# Altium schematic sheet adafruit flora mainboard 2.SchDoc: adafruit flora mainboard 2
size 301 x 234 mm; Date: 2019/8/22 下午 4:10:12; SheetNumber: 1; GateName_1: G$1; SymbolName_1: FRAME_A_L; LibraryName: frames; DeviceSetName: FRAME_A_L; GateName_2: G$2; SymbolName_2: DOCFIELD; Sheet: Sheet:; REV: REV:
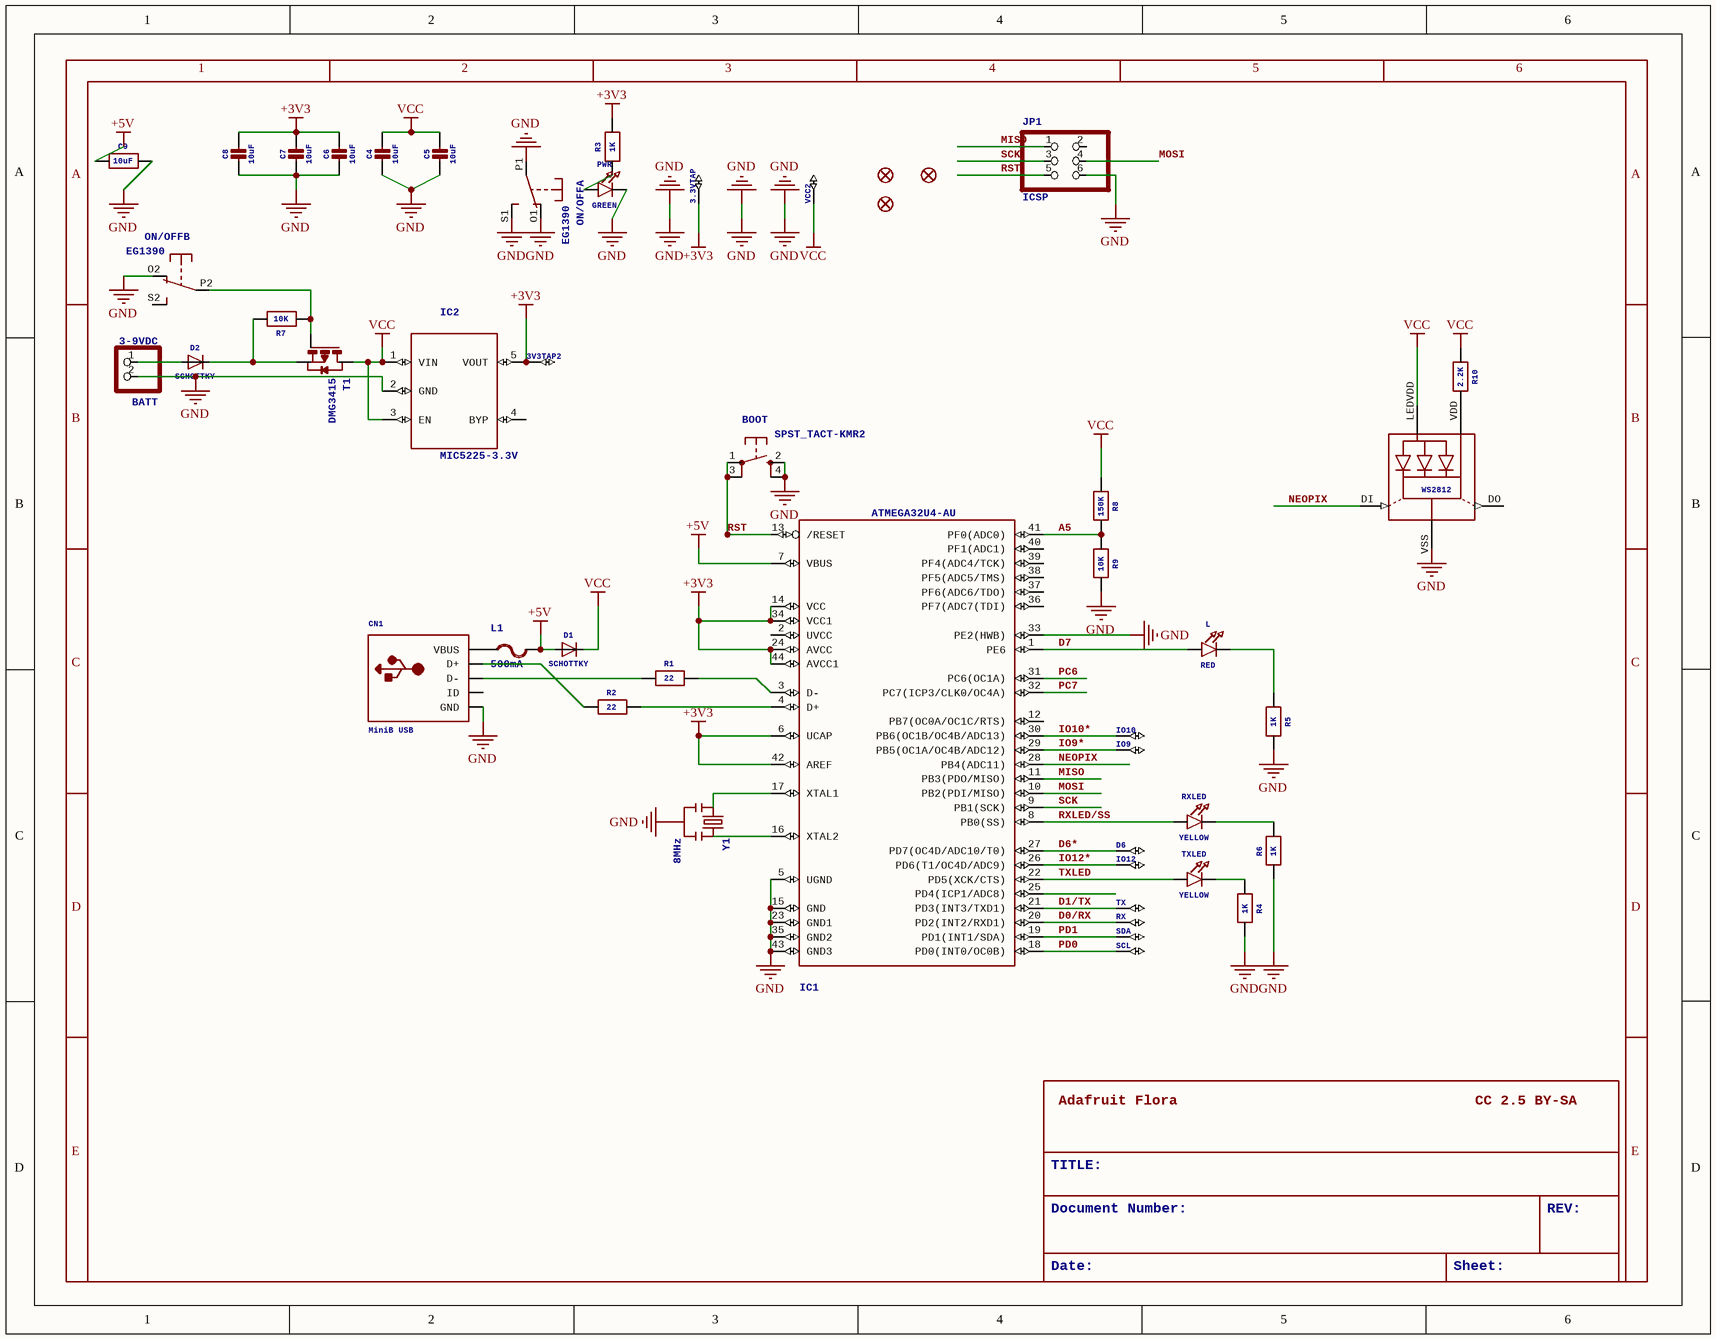
[diagram p0: adafruit flora mainboard 2.SchDoc]

## Parts
3.3VTAP  SEWTAP-2.0IN  [SEWINGTAP_2.0]  (value not drawn)
3V3TAP2  SEWTAP-2.0IN  [SEWINGTAP_2.0]  (value not drawn)
BATT  3-9VDC  [JST-PH-2-SMT-RA]
BOOT  SPST_TACT-KMR2  [KMR2]
C4  10uF  [0805-NO]
C5  10uF  [0805-NO]
C6  10uF  [0805-NO]
C7  10uF  [0805-NO]
C8  10uF  [0805-NO]
C9  10uF  [_0805MP]
CN1  MiniB USB  [4UCONN_20329]
D1  SCHOTTKY  [SOD-123]
D2  SCHOTTKY  [SOD-123]
D6  SEWTAP-2.0IN  [SEWINGTAP_2.0]  (value not drawn)
IC1  ATMEGA32U4-AU  [TQFP44]
IC2  MIC5225-3.3V  [SOT23-5L]
IO9  SEWTAP-2.0IN  [SEWINGTAP_2.0]  (value not drawn)
IO10  SEWTAP-2.0IN  [SEWINGTAP_2.0]  (value not drawn)
IO12  SEWTAP-2.0IN  [SEWINGTAP_2.0]  (value not drawn)
JP1  ICSP  [2X03]
L  RED  [CHIPLED_0805_NOOUTLINE]
L1  500mA  [R1206]
LED1  WS2812  [WS2812]
ON/OFF  EG1390  [EG1390]  (parts A,B of 2)
PWR  GREEN  [CHIPLED_0805_NOOUTLINE]
R1  22  [0805-NO]
R2  22  [0805-NO]
R3  1K  [_0805MP]
R4  1K  [_0805MP]
R5  1K  [0805-NO]
R6  1K  [0805-NO]
R7  10K  [_0805MP]
R8  150K  [0805-NO]
R9  10K  [0805-NO]
R10  2.2K  [0805-NO]
RX  SEWTAP-2.0IN  [SEWINGTAP_2.0]  (value not drawn)
RXLED  YELLOW  [CHIPLED_0805_NOOUTLINE]
SCL  SEWTAP-2.0IN  [SEWINGTAP_2.0]  (value not drawn)
SDA  SEWTAP-2.0IN  [SEWINGTAP_2.0]  (value not drawn)
T1  DMG3415  [SOT-23]
TX  SEWTAP-2.0IN  [SEWINGTAP_2.0]  (value not drawn)
TXLED  YELLOW  [CHIPLED_0805_NOOUTLINE]
U$2  FIDUCIAL""  [FIDUCIAL_1MM]  (value not drawn)
U$3  FIDUCIAL""  [FIDUCIAL_1MM]  (value not drawn)
U$6  FIDUCIAL""  [FIDUCIAL_1MM]  (value not drawn)
VCC2  SEWTAP-2.0IN  [SEWINGTAP_2.0]  (value not drawn)
Y1  8MHz  [RESONATOR-SMD]

## Nets
+3V3: 3.3VTAP.P$1(SEW) 3V3TAP2.P$1(SEW) C6.1 C7.1 C8.1 IC1.6(UCAP) IC1.14(VCC) IC1.24(AVCC) IC1.34(VCC1) IC1.42(AREF) IC1.44(AVCC1) IC2.5(VOUT) R3.2
+5V: C9.1 D1.A IC1.7(VBUS) L1.2
GND: BATT.2 BOOT.2(S) BOOT.4(S1) C4.2 C5.2 C6.2 C7.2 C8.2 C9.2 CN1.BASE@1_BASE@2_GND_SPRT@1_SPRT@2_SPRT@3_SPRT@4(GND) IC1.5(UGND) IC1.15(GND) IC1.23(GND1) IC1.33(PE2(HWB)) IC1.35(GND2) IC1.43(GND3) IC2.2(GND) JP1.6 LED1.VSS(GND) ON/OFF.O1(O) ON/OFF.O2(O) ON/OFF.P1(P) ON/OFF.S1(S) PWR.C R4.2 R5.2 R6.1 R9.2 Y1.2
VCC: C4.1 C5.1 D1.C IC2.1(VIN) IC2.3(EN) LED1.LEDVDD R8.1 R10.1 T1.1(D) VCC2.P$1(SEW)
A5: IC1.41(PF0(ADC0)) R8.2 R9.1
D0/RX: IC1.20(PD2(INT2/RXD1)) RX.P$1(SEW)
D1/TX: IC1.21(PD3(INT3/TXD1)) TX.P$1(SEW)
D6*: D6.P$1(SEW) IC1.27(PD7(OC4D/ADC10/T0))
D7: IC1.1(PE6) L.A
IO9*: IC1.29(PB5(OC1A/OC4B/ADC12)) IO9.P$1(SEW)
IO10*: IC1.30(PB6(OC1B/OC4B/ADC13)) IO10.P$1(SEW)
IO12*: IC1.26(PD6(T1/OC4D/ADC9)) IO12.P$1(SEW)
MISO: IC1.11(PB3(PDO/MISO)) JP1.1
MOSI: IC1.10(PB2(PDI/MISO)) JP1.4
NEOPIX: IC1.28(PB4(ADC11)) LED1.DI
PC6: IC1.31(PC6(OC1A))
PC7: IC1.32(PC7(ICP3/CLK0/OC4A))
PD0: IC1.18(PD0(INT0/OC0B)) SCL.P$1(SEW)
PD1: IC1.19(PD1(INT1/SDA)) SDA.P$1(SEW)
RST: BOOT.1(P) BOOT.3(P1) IC1.13(/RESET) JP1.5
RXLED/SS: IC1.8(PB0(SS)) RXLED.A
SCK: IC1.9(PB1(SCK)) JP1.3
TXLED: IC1.22(PD5(XCK/CTS)) TXLED.A
NetBATT_1: BATT.1 D2.A
NetCN1_D+: CN1.D+ R2.1
NetCN1_D-: CN1.D- R1.1
NetCN1_VBUS: CN1.VBUS L1.1
NetD2_C: D2.C R7.2 T1.2(S)
NetIC1_3: IC1.3(D-) R1.2
NetIC1_4: IC1.4(D+) R2.2
NetIC1_16: IC1.16(XTAL2) Y1.3
NetIC1_17: IC1.17(XTAL1) Y1.1
NetL_C: L.C R5.1
NetLED1_VDD: LED1.VDD R10.2
NetON/OFF_P2: ON/OFF.P2(P) R7.1 T1.3(G)
NetPWR_A: PWR.A R3.1
NetR4_1: R4.1 TXLED.C
NetR6_2: R6.2 RXLED.C

Not connected (* = marked no-connect by the designer): CN1 ID; IC1 2(UVCC) 12(PB7(OC0A/OC1C/RTS)) 25(PD4(ICP1/ADC8)) 36(PF7(ADC7(TDI)) 37(PF6(ADC6/TDO)) 38(PF5(ADC5/TMS)) 39(PF4(ADC4/TCK)) 40(PF1(ADC1)); IC2 4(BYP); JP1 2; LED1 DO; ON/OFF S2(S)

## Notes on the sheet
- Adafruit Flora
- CC 2.5 BY-SA
- TITLE:
- Document Number:
- REV:
- Date:
- Sheet:
- 1
- 2
- 3
- 4
- 5
- 6
- A
- B
- C
- D
- E

## Library data of the parts
3.3VTAP 3V3TAP2 D6 IO9 IO10 IO12 RX SCL SDA TX VCC2 = SEWTAP-2.0IN: GateName_1: G$1; SymbolName_1: SEWTAP; DeviceName: -2.0IN; LibraryName: adafruit; DeviceSetName: SEWTAP
BATT = JST_2PIN-SMT-RA: JST 2-Pin Connectors of various flavors SMT-RA (S2B-PH-SM4) 4UConnector #17311  SMT  (B2B-PH-SM4)  THM-RA (S2B-PH)  THM  (B2B-PH); GateName_1: G$1; SymbolName_1: PINHD2; DeviceName: -SMT-RA; LibraryName: adafruit; DeviceSetName: JST_2PIN
BOOT = SPST_TACT-KMR2: SMT 6mm switch, EVQQ2 series    http://www.ladyada.net/library/eagle; GateName_1: G$1; SymbolName_1: TS2; DeviceName: -KMR2; LibraryName: adafruit; DeviceSetName: SPST_TACT
C4-C8 = CAP_CERAMIC0805-NOOUTLINE: Ceramic Capacitors   For new designs, use the packages preceded by an '_' character since they are more reliable:   The following footprints should be used on most boards: _0402 - Standard footprint for regular board layouts  _0603 - Standard footprint for regular board layouts  _0805 - Standard footprint for regular board layouts  _1206 - Standard footprint for regular board layouts       For extremely tight-pitch boards where space is at a premium, the following 'micro-pitch' footprints can be used (smaller pads, no silkscreen outline, etc.): _0402MP - Micro-pitch footprint for very dense/compact boards  _0603MP - Micro-pitch footprint for very dense/compact boards  _0805MP - Micro-pitch footprint for very dense/compact boards  _1206MP - Micro-pitch footprint for very dense/compact boards; GateName_1: G$1; SymbolName_1: CAPACITOR; DeviceName: 0805-NOOUTLINE; LibraryName: microbuilder; DeviceSetName: CAP_CERAMIC
C9 R3 R4 R7 = RESISTOR_0805MP: Resistors   For new designs, use the packages preceded by an '_' character since they are more reliable:   The following footprints should be used on most boards: _0402 - Standard footprint for regular board layouts  _0603 - Standard footprint for regular board layouts  _0805 - Standard footprint for regular board layouts  _1206 - Standard footprint for regular board layouts       For extremely tight-pitch boards where space is at a premium, the following 'micro-pitch' footprints can be used (smaller pads, no silkscreen outline, etc.): _0402MP - Micro-pitch footprint for very dense/compact boards  _0603MP - Micro-pitch footprint for very dense/compact boards  _0805MP - Micro-pitch footprint for very dense/compact boards  _1206MP - Micro-pitch footprint for very dense/compact boards; GateName_1: G$1; SymbolName_1: RESISTOR; DeviceName: _0805MP; LibraryName: microbuilder; DeviceSetName: RESISTOR
CN1 = USBMICRO_20329: USB ConnectorsUSBMINIB - Surface Mount Female Mini-B USB Connector    4UConnector: 06564; GateName_1: G$1; SymbolName_1: USB; DeviceName: MICRO_20329; LibraryName: microbuilder; DeviceSetName: USB
D1 D2 = DIODESOD-123: Diode    SMA      Model	  Volts	  Amps	  Type	  Vf	  Ir	  Digikey #	  Notes	     SSA34-E3	  40V	  3A	  Schottky	  480mV @ 3A	  200uA @ 40V	  SSA34-E3/61TGITR-ND	  	     CDBA120-G	  20V	  1A	  Schottky	  500mV @ 1A	  500uA @ 20V	  641-1014-6-ND	  REEL	     MBRA210	  10V	  2A	  Schottky	  350mV @ 2A	  700uA @ 10V	  MBRA210LT3	  	 SOD-123      Model	  Volts	  Amps	  Type	  Vf	  Ir	  Order #	  Notes	     BAT54T1G	  30V	  200mA	  Schottky	  800mV @ 200mA	  2uA @ 25V	  BAT54T1GOSTR-ND	  	     B0530W	  30V	  500mA	  Schottky	  430mV @ 500mA	  130uA @ 30V	  B0530W-FDICT-ND	  REEL	     MBR120	  20V	  1A	  Schottky	  340mV @ 1A	  	  MBR120VLSFT1GOSCT-ND	  	 SOD-323      Model	  Volts	  Amps	  Type	  Vf	  Ir	  Order #	  Notes	     PMEG2005EJ	  20V	  500mA	  Schottky	  355mV @ 500mA	  	  568-4110-1-ND	  	     ZLLS410	  10V	  570mA	  Schottky	  380mV @ 570mA	  	  ZLLS410CT-ND	  	     1N4148WS	  75V	  150mA	  Silicon/Simple	  1V	  	  1N4148WSFSCT-ND	  REEL	 SOD-523      Model	  Volts	  Amps	  Type	  Vf	  Ir	  Order #	  Notes	     BAT54XV2	  30V	  200mA	  Schottky	  0.8V @ 100mA	  	  BAT54XV2CT-ND	  	     TB751S	  30V	  30mA	  Schottky	  	  	  RB751S-40TE61CT-ND	  	 SOT23-R/W (R = Solder Paste/Reflow Ovens, W = Hand-Soldering)       Model	  Volts	  Amps	  Type	  Vf	  Ir	  Order #	  Notes	     BAT54FILM	  40V	  300mA	  Schottky	  	  	  497-7162-1-ND	  	 POWERDI-5       Model	  Volts	  Amps	  Type	  Vf	  Ir	  Order #	  Notes	     PDS560	  60V	  5A	  Schottky	  670mV @ 5A	  150uA @ 60V	  PDS560DICT-ND; GateName_1: G$1; SymbolName_1: DIODE; DeviceName: SOD-123; LibraryName: microbuilder; DeviceSetName: DIODE
IC1 = ATMEGA32U4-AU: GateName_1: G$1; DeviceName: -AU; SymbolName_1: ATMEGA32U4; LibraryName: adaprog; DeviceSetName: ATMEGA32U4
IC2 = LP298XS: GateName_1: G$1; SymbolName_1: LP298X; DeviceName: S; LibraryName: adafruit; DeviceSetName: LP298X
JP1 = PINHD-2X3: PIN HEADER; GateName_1: A; SymbolName_1: PINH2X3; LibraryName: pinhead; DeviceSetName: PINHD-2X3
L PWR RXLED TXLED = LED0805_NOOUTLINE: LED0603 - 0603 Surface Mount Package    2mA: Green LED - Low Power (3.9mcd, 2ma, 1.7Vf) - Digikey: 475-2709-2-ND  Orange LED - Low Power (9.8mcd, 2ma, 1.8Vf) - Digikey: 475-1194-2-ND  Red LED - Low Power (5mcd, 2ma, 1.8Vf) - Digikey: 475-1195-2-ND  Yellow LED - Low Power (7mcd, 2ma, 1.8Vf) - Digikey: 475-1196-2-ND       5mA: Blue LED - Low Power (17mcd, 5ma, 2.9Vf) - Digikey: LNJ937W8CRACT-ND    0805 - 0805 Surface Mount Package    2mA: Red LED (8.8mcd, 2mA, 1.8Vf, Clear) - Low Power [Digikey: 475-2510-1-ND]  Green LED (5mcd, 2mA, 1.8Vf, Clear) - Low Power [Digikey: 475-2730-1-ND]  Yellow LED (11.3mcd, 2mA, 1.8Vf, Clear) - Low Power [Digikey: 475-2555-1-ND]       20mA: Red LED (104mcd, 20mA, Diffused) - LS R976 [Digikey: 475-1278-6-ND]  Red LED (12mcd, 20mA, 2.0Vf, Clear) - APT2012EC [Digikey: 754-1128-1-ND]  Green LED (15mcd, 20mA, 2.2Vf, Clear) - APT2012GC [Digikey: 754-1131-1-ND]  Orange LED (160mcd, 20mA, 2.1Vf, Clear) - APT2012SECK [Digikey: 754-1130-1-ND]     1206 - 1206 Surface Mount Package  Green LED (26mcd, 20mA, Diffused) - LG N971  [Digikey: 475-1407-6-ND]  Red LED (15mcd, 20mA, Diffused) - LH N974 [Digikey: 475-1416-6-ND]     Cree - Cree High-Power Surface Mount LEDs  XPEBWT-L1-0000-00D50 - White 111lm 350mA 2.9Vf 6200K 110掳  XTEAWT-00-0000-00000LEE3 - White 114lm 350mA 2.85Vf 5000K 115掳     Everlight - Everlight 45-21 Series Surface Mount LEDs  45-21/QK2C-B2832AC2CB2/2T - Warm White 2000mcd 20mA 3.25Vf 3050K 120掳  45-21/LK2C-B38452C4CB2/2T - Nuetral White 2000mcd 20mA 3.25Vf 4150K 120掳  45-21/LK2C-B50634C6CB2/2T - Cold White 2200mcd 20mA 3.25Vf 5650K 120掳     PLCC2 Reverse Mount LS T77K-J1L2-1-0-2-R18-Z - Red 11.25mcd 2mA 1.8Vf 630nm 120掳  LO T77K-L1M2-24-Z - Orange 19.6mcd 2mA 1.8Vf 606nm 120掳  LY T77K-K2M1-26-Z - Yellow 15.7mcd 2mA 1.8Vf 587nm 120掳; GateName_1: G$1; SymbolName_1: LED; DeviceName: 0805_NOOUTLINE; LibraryName: microbuilder; DeviceSetName: LED
L1 = PTCFUSE-1206: PTC fuses, resettable thermistors; GateName_1: G$1; SymbolName_1: FUSE; DeviceName: -1206; LibraryName: adafruit; DeviceSetName: PTCFUSE
LED1 = WS2812: GateName_1: G$1; SymbolName_1: WS2812; LibraryName: adafruit; DeviceSetName: WS2812; WS2812: WS2812
ON/OFF = DPDT-EG1390: GateName_1: 1; SymbolName_1: TSU; GateName_2: 2; DeviceSetName: DPDT; SymbolName_2: TSU; DeviceName: -EG1390; LibraryName: adafruit
R1 R2 R5 R6 R8-R10 = RESISTOR0805_NOOUTLINE: Resistors   For new designs, use the packages preceded by an '_' character since they are more reliable:   The following footprints should be used on most boards: _0402 - Standard footprint for regular board layouts  _0603 - Standard footprint for regular board layouts  _0805 - Standard footprint for regular board layouts  _1206 - Standard footprint for regular board layouts       For extremely tight-pitch boards where space is at a premium, the following 'micro-pitch' footprints can be used (smaller pads, no silkscreen outline, etc.): _0402MP - Micro-pitch footprint for very dense/compact boards  _0603MP - Micro-pitch footprint for very dense/compact boards  _0805MP - Micro-pitch footprint for very dense/compact boards  _1206MP - Micro-pitch footprint for very dense/compact boards; GateName_1: G$1; SymbolName_1: RESISTOR; DeviceName: 0805_NOOUTLINE; LibraryName: microbuilder; DeviceSetName: RESISTOR
T1 = PMOSSOT23: MOS FET; GateName_1: A; SymbolName_1: P_MOSFET; LibraryName: zetex; DeviceSetName: PMOSSOT23; MF: *; MPN: *; OC_FARNELL: unknown; OC_NEWARK: unknown
U$2 U$3 U$6 = FIDUCIAL"": Fiducial Alignment Points   Various fiducial points for machine vision alignment.; GateName_1: G$1; DeviceName: ""; BOM: EXCLUDE; SymbolName_1: FIDUCIAL; LibraryName: microbuilder; DeviceSetName: FIDUCIAL
Y1 = RESONATORSMD: ResonatorSmall SMD resonator. This is the itty bitty 10/20MHz resonators with built in caps. CSTCE10M0G55 and CSTCE20M0V53. Footprint has been reviewed closely but hasn't been tested yet.; GateName_1: G$1; SymbolName_1: RESONATOR; DeviceName: SMD; LibraryName: SparkFun; DeviceSetName: RESONATOR